# Altium schematic sheet AIRZAI_NFC_READER_FLEX.SchDoc
size A3
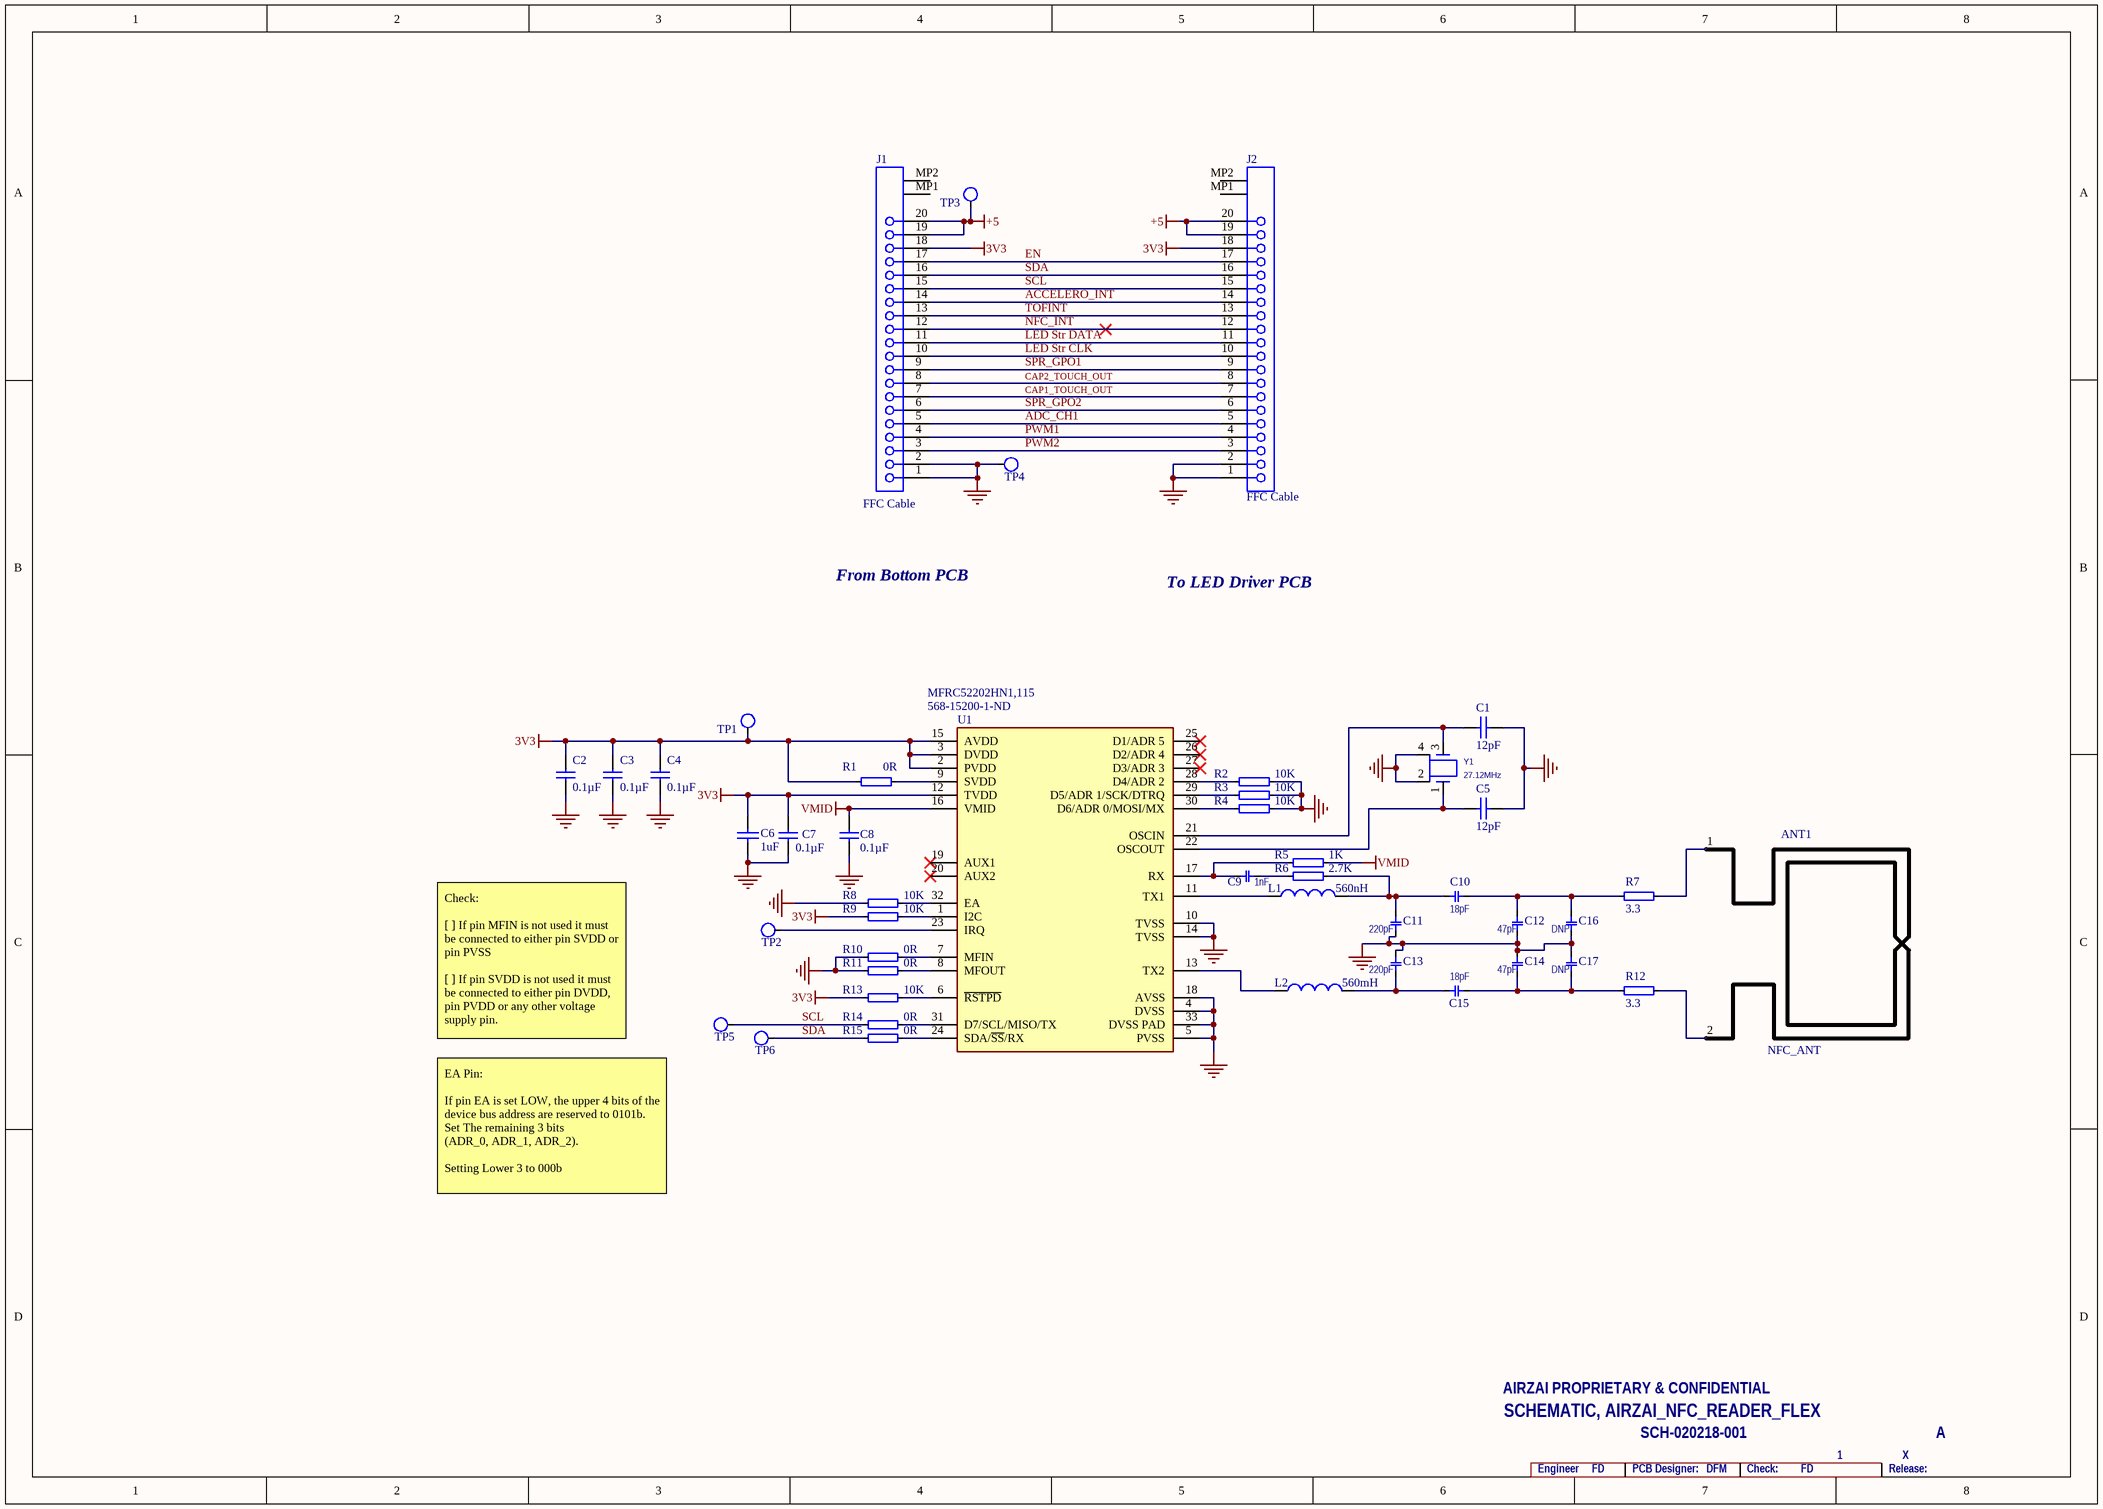
[diagram p0: AIRZAI_NFC_READER_FLEX.SchDoc]

## Parts
ANT1  NFC_ANT  [ANTENNA-NFC-60MMX30MM]
C1  12pF  [0402CAP]
C2  0.1µF  [0402CAP]
C3  0.1µF  [0402CAP]
C4  0.1µF  [0402CAP]
C5  12pF  [0402CAP]
C6  1uF  [CAPC0402(1005)60_M]
C7  0.1µF  [0402CAP]
C8  0.1µF  [0402CAP]
C9  1nF  [0402CAP]
C10  18pF  [0402CAP]
C11  220pF  [0402CAP]
C12  47pF  [0402CAP]
C13  220pF  [0402CAP]
C14  47pF  [0402CAP]
C15  18pF  [0402CAP]
C16  DNP  [0402CAP]
C17  DNP  [0402CAP]
J1  FFC Cable  [FFC_Pads_MBD]
J2  FFC Cable  [FFC_Pads_LID]
L1  560nH  [0603CAP]
L2  560mH  [0603CAP]
R1  0R  [0402]
R2  10K  [0402]
R3  10K  [0402]
R4  10K  [0402]
R5  1K  [0402]
R6  2.7K  [0402]
R7  3.3  [0603]
R8  10K  [0402]
R9  10K  [0402]
R10  0R  [0402]
R11  0R  [0402]
R12  3.3  [0603]
R13  10K  [0402]
R14  0R  [0402]
R15  0R  [0402]
TP1  WIREPT  [TP_0.9MM]  (value not drawn)
TP2  WIREPT  [TP_0.9MM]  (value not drawn)
TP3  WIREPT  [TP_0.9MM]  (value not drawn)
TP4  WIREPT  [TP_0.9MM]  (value not drawn)
TP5  WIREPT  [TP_0.9MM]  (value not drawn)
TP6  WIREPT  [TP_0.9MM]  (value not drawn)
U1  Supplier Part Number 1: 568-15200-1-ND  [VFQFN-32-MFRC52202HN1,157]  (hidden comment: MFRC52202HN1,115)
Y1  27.12MHz  [XTAL_2016]

## Nets
3V3: C2.1 C3.1 C4.1 C6.2 C7.1 J1.18 J2.18 R1.2 R9.2 R13.2 TP1.1 U1.2(PVDD) U1.3(DVDD) U1.12(TVDD) U1.15(AVDD)
+5: J1.19 J1.20 J2.19 J2.20 TP3.1
GND: C1.1 C2.2 C3.2 C4.2 C5.1 C6.1 C7.2 C8.2 C11.1 C12.1 C13.2 C14.2 C16.1 C17.2 J1.1 J1.2 J2.1 J2.2 R2.1 R3.1 R4.1 R8.2 R10.2 R11.2 TP4.1 U1.4(DVSS) U1.5(PVSS) U1.10(TVSS) U1.14(TVSS) U1.18(AVSS) U1.33(DVSS_PAD) Y1.2 Y1.4
VMID: C8.1 R5.1 U1.16(VMID)
ACCELERO_INT: J1.14 J2.14
ADC_CH1: J1.5 J2.5
CAP1_TOUCH_OUT: J1.7 J2.7
CAP2_TOUCH_OUT: J1.8 J2.8
EN: J1.17 J2.17
LED Str CLK: J1.10 J2.10
LED Str DATA: J1.11 J2.11
NFC_INT: J1.12 J2.12
PWM1: J1.4 J2.4
PWM2: J1.3 J2.3
SCL: J1.15 J2.15 R14.2 TP5.1
SDA: J1.16 J2.16 R15.2 TP6.1
SPR_GPO1: J1.9 J2.9
SPR_GPO2: J1.6 J2.6
TOFINT: J1.13 J2.13
NetANT1_1: ANT1.1 R7.1
NetANT1_2: ANT1.2 R12.1
NetC1_2: C1.2 U1.21(OSCIN) Y1.3
NetC5_2: C5.2 U1.22(OSCOUT) Y1.1
NetC9_1: C9.1 R6.2
NetC9_2: C9.2 R5.2 U1.17(RX)
NetC10_1: C10.1 C12.2 C16.2 R7.2
NetC10_2: C10.2 C11.2 L1.2 R6.1
NetC13_1: C13.1 C15.2 L2.2
NetC14_1: C14.1 C15.1 C17.1 R12.2
NetL1_1: L1.1 U1.11(TX1)
NetL2_1: L2.1 U1.13(TX2)
NetR1_1: R1.1 U1.9(SVDD)
NetR2_2: R2.2 U1.28(D4/ADR_2)
NetR3_2: R3.2 U1.29(D5/ADR_1/SCK/DTRQ)
NetR4_2: R4.2 U1.30(D6/ADR_0/MOSI/MX)
NetR8_1: R8.1 U1.32(EA)
NetR9_1: R9.1 U1.1(I2C)
NetR10_1: R10.1 U1.7(MFIN)
NetR11_1: R11.1 U1.8(MFOUT)
NetR13_1: R13.1 U1.6(~{RSTPD})
NetR14_1: R14.1 U1.31(D7/SCL/MISO/TX)
NetR15_1: R15.1 U1.24(SDA/~{SS}/RX)
NetTP2_1: TP2.1 U1.23(IRQ)

Not connected (* = marked no-connect by the designer): J1 MP1 MP2; J2 MP1 MP2; U1 19(AUX1)* 20(AUX2)* 25(D1/ADR_5)* 26(D2/ADR_4)* 27(D3/ADR_3)*

## Notes on the sheet
- From Bottom PCB
- To LED Driver PCB
- Check:
  [ ] If pin MFIN is not used it must be connected to either pin SVDD or pin PVSS
  [ ] If pin SVDD is not used it must be connected to either pin DVDD, pin PVDD or any other voltage supply pin.
- EA Pin:
  If pin EA is set LOW, the upper 4 bits of the device bus address are reserved to 0101b. Set The remaining 3 bits
  (ADR_0, ADR_1, ADR_2).
  Setting Lower 3 to 000b
- AIRZAI PROPRIETARY & CONFIDENTIAL
- SCHEMATIC, AIRZAI_NFC_READER_FLEX
- SCH-020218-001
- 1
- X
- A
- Engineer
- FD
- PCB Designer:
- DFM
- Check:
- Release:
- Title
- Size:
- Date:
- A3
- Number:
- Time:
- Revision:
- Sheet
- of
- File:

## Library data of the parts
C1 C5 = CAP: CAP CER 12PF 50V C0G/NP0 0402; Manufacturer: KEMET; Manufacturer Part Number: C0402C120J5GACTU; Dielectric Material: Ceramic; Tolerance: 5%; Dielectric: C0G; Temperature Coefficient: 30ppm/°C; Value: 12pF; ComponentLink1URL: https://www.yuden.co.jp/productdata/catalog/mlcc01_e.pdf?src-supplier=Digi-Key; ComponentLink1Description: https://www.yuden.co.jp/productdata/catalog/mlcc01_e.pdf?src-supplier=Digi-Key; ComponentLink2URL: http://www.onlinecomponents.com/productFiles/mf-TAI/964emk105bj105kv-f.pdf?src-supplier=Onlinecomponents.com; ComponentLink2Description: http://www.onlinecomponents.com/productFiles/mf-TAI/964emk105bj105kv-f.pdf?src-supplier=Onlinecomponents.com; ComponentLink3URL: http://www.farnell.com/datasheets/2091854.pdf?src-supplier=Element14; ComponentLink3Description: http://www.farnell.com/datasheets/2091854.pdf?src-supplier=Element14; ComponentLink4URL: https://www.verical.com/server-webapp/html/getDatasheet?partID=638287&src-supplier=Verical; ComponentLink4Description: https://www.verical.com/server-webapp/html/getDatasheet?partID=638287&src-supplier=Verical; ComponentLink5URL: http://ds.yuden.co.jp/TYCOMPAS/ut/detail.do?productNo=EMK105BJ105KV-F&fileName=EMK105BJ105KV-F_SS&mode=specSheetDownload&src-supplier=Mouser; ComponentLink5Description: http://ds.yuden.co.jp/TYCOMPAS/ut/detail.do?productNo=EMK105BJ105KV-F&fileName=EMK105BJ105KV-F_SS&mode=specSheetDownload&src-supplier=Mouser; ComponentLink6URL: http://www.farnell.com/datasheets/1497285.pdf?src-supplier=Element14; ComponentLink6Description: http://www.farnell.com/datasheets/1497285.pdf?src-supplier=Element14; Supplier 1: Digi-Key; Supplier Part Number 1: 399-1013-6-ND; Stock 1: 1653435; Pricing 1: 1=0.1, 10=0.055, 100=0.0243, 500=0.01738, 1000=0.01366, 2500=0.01242, 5000=0.01143 (USD); Mount: Surface Mount,PCB; Case/Package: 0402; Number of Pins: 2; Case Code (Metric): 1005; Case Code (Imperial): 0402; Min Operating Temperature: -55°C; Max Operating Temperature: 125°C; Capacitance: 12pF; Voltage Rating: 50V; Voltage Rating (DC): 50V; Packaging: Tape and Reel; Package Quantity: 1; Termination: SMD/SMT; Voltage: 50V; Length: 1mm; Height: 0.5mm; Width: 0.02inch; Thickness: 0.022inch; Lead Pitch: 0.3mm; Depth: 0.5mm; Radiation Hardening: No; REACH SVHC: No SVHC; Lead Free: Lead Free; ComponentLink7URL: http://www.farnell.com/datasheets/2119935.pdf?src-supplier=Element14; ComponentLink7Description: http://www.farnell.com/datasheets/2119935.pdf?src-supplier=Element14; ComponentLink8URL: http://www.farnell.com/datasheets/2740746.pdf?src-supplier=Newark; ComponentLink8Description: http://www.farnell.com/datasheets/2740746.pdf?src-supplier=Newark; ComponentLink9URL: http://www.mouser.com/ds/2/212/KEM_C1003_C0G_SMD-1101588.pdf?src-supplier=Mouser; ComponentLink9Description: http://www.mouser.com/ds/2/212/KEM_C1003_C0G_SMD-1101588.pdf?src-supplier=Mouser; ComponentLink10URL: https://www.alliedelec.com/m/d/9bfe7773041ffe9d406e68bc7b377fdd.pdf?src-supplier=Allied+Electronics; ComponentLink10Description: https://www.alliedelec.com/m/d/9bfe7773041ffe9d406e68bc7b377fdd.pdf?src-supplier=Allied+Electronics
C2-C4 C7 C8 = C0402-100n: Capacitor, X7R, ±10%; Manufacturer: TDK; Manufacturer Part Number: C1005X7R1C104K; Note: 16V ±10% X7R; Case-EIA: 0402; Case-Metric: 1005; Rated Voltage: 16 V; Tolerance: Â±20%; Datasheet: *; Footprint: 0402; Pin Count: 2; Value: 0.1µF; Supplier: *; Supplier part number: *; 2nd source Supplier: *; 2nd source part number: *; Max Thickness: 0.6 mm; Supplier 1: Digi-Key; Supplier Part Number 1: 445-4952-2-ND; Technology: SMT
C6 = CAP: CAP 1uF 16V ±10% 0402 (1005 Metric) Thickness 0.6mm SMD; Manufacturer: Taiyo Yuden; Manufacturer Part Number: EMK105BJ105KV-F; Dielectric: X5R; Value: 1uF; Supplier 1: Digi-Key; Supplier Part Number 1: 587-2477-6-ND; Stock 1: 1414379; Pricing 1: 1=0.1, 10=0.076, 100=0.0337, 500=0.02406, 1000=0.01891, 2500=0.01719, 5000=0.01581 (USD); Mount: Surface Mount; Case/Package: 0402; Number of Pins: 2; Case Code (Metric): 1005; Case Code (Imperial): 0402; Min Operating Temperature: -55°C; Max Operating Temperature: 85°C; Capacitance: 1uF; Tolerance: 10%; Packaging: Tape and Reel; Voltage Rating (DC): 16V; Package Quantity: 1; Voltage Rating: 16V; Termination: SMD/SMT; Length: 1mm; Height: 0.5mm; Width: 0.02inch; Thickness: 0.022inch; Depth: 0.5mm; Radiation Hardening: No; REACH SVHC: Unknown; Halogen Free: Halogen Free; ComponentLink1URL: https://www.yuden.co.jp/productdata/catalog/mlcc01_e.pdf?src-supplier=Digi-Key; ComponentLink1Description: https://www.yuden.co.jp/productdata/catalog/mlcc01_e.pdf?src-supplier=Digi-Key; ComponentLink2URL: http://www.onlinecomponents.com/productFiles/mf-TAI/964emk105bj105kv-f.pdf?src-supplier=Onlinecomponents.com; ComponentLink2Description: http://www.onlinecomponents.com/productFiles/mf-TAI/964emk105bj105kv-f.pdf?src-supplier=Onlinecomponents.com; ComponentLink3URL: http://www.farnell.com/datasheets/2091854.pdf?src-supplier=Element14; ComponentLink3Description: http://www.farnell.com/datasheets/2091854.pdf?src-supplier=Element14; ComponentLink4URL: https://www.verical.com/server-webapp/html/getDatasheet?partID=638287&src-supplier=Verical; ComponentLink4Description: https://www.verical.com/server-webapp/html/getDatasheet?partID=638287&src-supplier=Verical; ComponentLink5URL: http://ds.yuden.co.jp/TYCOMPAS/ut/detail.do?productNo=EMK105BJ105KV-F&fileName=EMK105BJ105KV-F_SS&mode=specSheetDownload&src-supplier=Mouser; ComponentLink5Description: http://ds.yuden.co.jp/TYCOMPAS/ut/detail.do?productNo=EMK105BJ105KV-F&fileName=EMK105BJ105KV-F_SS&mode=specSheetDownload&src-supplier=Mouser; ComponentLink6URL: http://www.farnell.com/datasheets/1497285.pdf?src-supplier=Element14; ComponentLink6Description: http://www.farnell.com/datasheets/1497285.pdf?src-supplier=Element14
C9 = 56p: CAP CER 1000PF 50V C0G/NP0 0402; Manufacturer: Murata; Manufacturer Part Number: GRM1555C1H102FA01D; Material: Ceramic; Tolerance: 1%; Dielectric: C0G; VALUE: 1nF; Supplier 1: Digi-Key; Supplier Part Number 1: 490-6189-1-ND; Stock 1: 2792285; Pricing 1: 1 = 0.23000, 10 = 0.15400, 100 = 0.07780, 500 = 0.05322, 1000 = 0.04708, 2500 = 0.04504, 5000 = 0.04094 (USD); RoHS: Yes; Mount: Surface Mount; Case/Package: 0402; Case Code (Metric): 1005; Case Code (Imperial): 0402; Min Operating Temperature: -55°C; Max Operating Temperature: 125°C; Capacitance: 1nF; Packaging: Tape and Reel; Package Quantity: 1; Voltage Rating: 50V; Termination: SMD/SMT; Voltage: 50V; Voltage Rating (DC): 50V; Length: 1mm; Height: 0.5mm; Width: 0.02inch; Thickness: 0.022inch; Depth: 0.5mm; Radiation Hardening: No; REACH SVHC: No SVHC; Lead Free: Lead Free; ComponentLink1URL: https://datasheet.ciiva.com/11621/c02e-11621677.pdf?src-supplier=Avnet; ComponentLink1Description: https://datasheet.ciiva.com/11621/c02e-11621677.pdf?src-supplier=Avnet; ComponentLink2URL: https://datasheet.ciiva.com/6270/partnumbering-e-01-6270478.pdf?src-supplier=Digi-Key; ComponentLink2Description: https://datasheet.ciiva.com/6270/partnumbering-e-01-6270478.pdf?src-supplier=Digi-Key; ComponentLink3URL: https://datasheet.ciiva.com/6270/partnumbering-e-01-6270477.pdf?src-supplier=Digi-Key; ComponentLink3Description: https://datasheet.ciiva.com/6270/partnumbering-e-01-6270477.pdf?src-supplier=Digi-Key
C10 C15 = 56p: CAP CER 18PF 50V NP0 0402; Manufacturer: Kyocera AVX; Manufacturer Part Number: 04025U180FAT2A; Tolerance: 1%; Dielectric: C0G; VALUE: 18pF; ComponentLink1URL: https://datasheet.ciiva.com/6257/kem-c1030-cbr-smd-6257578.pdf?src-supplier=Digi-Key; ComponentLink1Description: https://datasheet.ciiva.com/6257/kem-c1030-cbr-smd-6257578.pdf?src-supplier=Digi-Key; ComponentLink2URL: https://datasheet.ciiva.com/6257/kem-c1030-cbr-smd-6257580.pdf?src-supplier=Digi-Key; ComponentLink2Description: https://datasheet.ciiva.com/6257/kem-c1030-cbr-smd-6257580.pdf?src-supplier=Digi-Key; ComponentLink3URL: https://datasheet.ciiva.com/6257/kem-c1030-cbr-smd-6257582.pdf?src-supplier=Digi-Key; ComponentLink3Description: https://datasheet.ciiva.com/6257/kem-c1030-cbr-smd-6257582.pdf?src-supplier=Digi-Key; Supplier 1: Digi-Key; Supplier Part Number 1: 478-10144-1-ND; Stock 1: 9413; Pricing 1: 1 = 0.38000, 10 = 0.26300, 100 = 0.15780, 500 = 0.11832, 1000 = 0.09991, 2500 = 0.09465, 5000 = 0.08939 (USD); RoHS: Yes; Mount: Surface Mount; Case/Package: 0402; Case Code (Metric): 1005; Case Code (Imperial): 0402; Contact Plating: Tin; Min Operating Temperature: -55°C; Max Operating Temperature: 125°C; Capacitance: 18pF; Package Quantity: 10000; Voltage Rating: 50V; Packaging: Tape and Reel; Voltage Rating (DC): 50V; Termination: SMD/SMT; Composition: Ceramic; Length: 1mm; Width: 0.02inch; Thickness: 0.022inch; Depth: 0.5mm; Radiation Hardening: No; Lead Free: Lead Free; ComponentLink4URL: https://datasheet.ciiva.com/6269/useries-6269560.pdf?src-supplier=Digi-Key; ComponentLink4Description: https://datasheet.ciiva.com/6269/useries-6269560.pdf?src-supplier=Digi-Key; ComponentLink5URL: https://datasheet.ciiva.com/16327/useries-16327647.pdf?src-supplier=Future+Electronics; ComponentLink5Description: https://datasheet.ciiva.com/16327/useries-16327647.pdf?src-supplier=Future+Electronics
C11 C13 = 56p: CAP CER 220PF 50V NPO 0402; Manufacturer: Yageo; Manufacturer Part Number: CC0402FRNPO9BN221; Tolerance: 1%; Dielectric: C0G; VALUE: 220pF; ComponentLink1URL: https://datasheet.ciiva.com/15189/getdatasheetpartid-317481-15189141.pdf?src-supplier=Verical; ComponentLink1Description: https://datasheet.ciiva.com/15189/getdatasheetpartid-317481-15189141.pdf?src-supplier=Verical; ComponentLink2URL: https://datasheet.ciiva.com/11587/upy-gp-np0-16v-to-50v-8-11587311.pdf?src-supplier=Avnet; ComponentLink2Description: https://datasheet.ciiva.com/11587/upy-gp-np0-16v-to-50v-8-11587311.pdf?src-supplier=Avnet; ComponentLink3URL: https://datasheet.ciiva.com/13264/upy-gp-np0-16v-to-50v-8-3714-13264357.pdf?src-supplier=Mouser; ComponentLink3Description: https://datasheet.ciiva.com/13264/upy-gp-np0-16v-to-50v-8-3714-13264357.pdf?src-supplier=Mouser; ComponentLink4URL: https://datasheet.ciiva.com/16623/upy-gp-np0-16v-to-50v-8-16623951.pdf?src-supplier=Avnet+Europe; ComponentLink4Description: https://datasheet.ciiva.com/16623/upy-gp-np0-16v-to-50v-8-16623951.pdf?src-supplier=Avnet+Europe; Supplier 1: Digi-Key; Supplier Part Number 1: 311-3730-1-ND; Stock 1: 23487; Pricing 1: 1 = 0.17000, 10 = 0.11700, 100 = 0.05520, 500 = 0.03872, 1000 = 0.03205, 2500 = 0.02983, 5000 = 0.02729 (USD); RoHS: Yes; Mount: Surface Mount; Case/Package: 0402; Weight: 2.3E-05oz; Case Code (Imperial): 0402; Case Code (Metric): 1005; Min Operating Temperature: -55°C; Max Operating Temperature: 125°C; Packaging: Tape and Reel; Voltage Rating: 50V; Voltage Rating (DC): 50V; Capacitance: 220pF; Termination: SMD/SMT; Composition: Ceramic; Length: 1mm; Height: 0.5mm; Width: 0.5mm; Thickness: 0.022inch; Depth: 0.5mm; Radiation Hardening: No; Lead Free: Lead Free; ComponentLink5URL: https://datasheet.ciiva.com/17434/upy-gp-np0-16v-to-50v-8-17434283.pdf?src-supplier=Avnet+Europe; ComponentLink5Description: https://datasheet.ciiva.com/17434/upy-gp-np0-16v-to-50v-8-17434283.pdf?src-supplier=Avnet+Europe; ComponentLink6URL: https://datasheet.ciiva.com/26918/getdatasheetpartid-403443-26918299.pdf?src-supplier=Verical; ComponentLink6Description: https://datasheet.ciiva.com/26918/getdatasheetpartid-403443-26918299.pdf?src-supplier=Verical
C12 C14 = 56p: CAP CER 47PF 50V C0G/NP0 0402; Manufacturer: Murata; Manufacturer Part Number: GJM1555C1H470FB01D; Tolerance: 1%; Dielectric: C0G; VALUE: 47pF; Supplier 1: Digi-Key; Supplier Part Number 1: 490-16376-1-ND; Stock 1: 48815; Pricing 1: 1 = 0.28000, 10 = 0.19300, 100 = 0.09760, 500 = 0.06678, 1000 = 0.05908, 2500 = 0.05651, 5000 = 0.05137 (USD); RoHS: No; Capacitance: 47pF; Voltage Rating (DC): 50V; Length: 1mm; Thickness: 500um; Width: 500um; ComponentLink1URL: http://search.murata.co.jp/Ceramy/image/img/A01X/G101/ENG/GJM1555C1H470FB01-01.pdf?src-supplier=Digi-Key; ComponentLink1Description: http://search.murata.co.jp/Ceramy/image/img/A01X/G101/ENG/GJM1555C1H470FB01-01.pdf?src-supplier=Digi-Key
C16 C17 = 56p: VALUE: DNP; ComponentLink1URL: http://search.murata.co.jp/Ceramy/image/img/A01X/G101/ENG/GJM1555C1H470FB01-01.pdf?src-supplier=Digi-Key; ComponentLink1Description: http://search.murata.co.jp/Ceramy/image/img/A01X/G101/ENG/GJM1555C1H470FB01-01.pdf?src-supplier=Digi-Key
J1 J2 = XF2M-2015-1A-R100: Cable; ComponentLink1URL: http://www.molex.com/molex/index.jsp; ComponentLink2URL: http://www.molex.com/webdocs/datasheets/pdf/en-us/0528922033_FFC_FPC_CONNECTORS.pdf; ComponentLink3Description: Package Specification; ComponentLink3URL: http://www.molex.com/pdm_docs/sd/528922033_sd.pdf; ComponentLink1Description: Manufacturer URL
L1 L2 = Inductor: FIXED IND 560NH 100MA 1.05 OHM; Manufacturer: TDK; Manufacturer Part Number: MLF1608DR56JTD25; Core Material: Ferrite; Tolerance: 5%; DC Resistance (DCR): 1.05R; Shielding: Shielded; Self Resonant Frequency: 170MHz; Test Frequency: 25MHz; Max DC Current: 30mA; Q Factor: 35; Supplier 1: Digi-Key; Supplier Part Number 1: 445-16970-1-ND; Stock 1: 60308; Pricing 1: 1 = 0.33000, 10 = 0.29000, 100 = 0.19920, 500 = 0.17026, 1000 = 0.13041 (USD); RoHS: Yes; Mount: Surface Mount; Case/Package: 0603; Weight: 0.000141oz; Case Code (Metric): 1608; Case Code (Imperial): 0603; Min Operating Temperature: -55°C; Max Operating Temperature: 125°C; Inductance: 560nH; Packaging: Tape and Reel; Package Quantity: 4000; Current Rating: 100mA; Termination: SMD/SMT; Length: 0.063inch; Height: 0.8mm; Width: 0.8mm; Height - Seated (Max): 0.037inch; Ratings: AEC-Q200; ComponentLink1URL: https://datasheet.ciiva.com/41835/inductor-automotive-standard-mlf-en-41835679.pdf?src-supplier=Digi-Key; ComponentLink1Description: https://datasheet.ciiva.com/41835/inductor-automotive-standard-mlf-en-41835679.pdf?src-supplier=Digi-Key
  L1: Value: 560nH
  L2: Value: 560mH
R1 R10 R11 R14 R15 = R0402-12k: Resistor, ±1%, 0.063W; Manufacturer: Panasonic; Manufacturer Part Number: ERJ-2GE0R00X; Note: 0.1W JUMPER; Case-Metric: 1005; Tolerance: ±5%; Datasheet: *; Pin Count: 2; Value: 0R; 2nd source Supplier: *; 2nd source part number: *; Case-EIA: 0402; Max Thickness: 0.6mm; Supplier 1: Digi-Key; Supplier Part Number 1: P0.0JTR-ND; Technology: SMT
R2-R4 R8 R9 R13 = R0402-12k: Resistor 10K, ±1%, 0.063W; Manufacturer: Vishay Dale; Manufacturer Part Number: CRCW040210K0JNED; Resistance: 10kR; Power Rating: 63mW; Tolerance: 5%; Voltage Rating: 50V; Temperature Coefficient: 200ppm/°C; Value: 10K; Supplier 1: Digi-Key; Supplier Part Number 1: 541-10KJDKR-ND; Stock 1: 2; Pricing 1: 1=0.1, 10=0.034, 100=0.0138, 1000=0.00618, 2500=0.00536, 5000=0.00443 (USD); Mount: Surface Mount; Case/Package: 0402; Weight: 2.3E-05oz; Case Code (Imperial): 0402; Case Code (Metric): 1005; Contact Plating: Tin; Min Operating Temperature: -55°C; Max Operating Temperature: 155°C; Packaging: Tape and Reel; Package Quantity: 1; Termination: SMD/SMT; Composition: Thick Film; Number of Terminations: 2; Military Standard: Not; Max Power Dissipation: 63mW; Features: Automotive AEC-Q200; Length: 1mm; Height: 0.016inch; Width: 0.5mm; Depth: 0.5mm; Radiation Hardening: No; REACH SVHC: Unknown; ComponentLink1URL: http://www.vishay.com/docs/20035/dcrcwe3.pdf?src-supplier=Digi-Key; ComponentLink1Description: http://www.vishay.com/docs/20035/dcrcwe3.pdf?src-supplier=Digi-Key; ComponentLink2URL: http://www.farnell.com/datasheets/2045673.pdf?src-supplier=Element14; ComponentLink2Description: http://www.farnell.com/datasheets/2045673.pdf?src-supplier=Element14; ComponentLink3URL: https://www.alliedelec.com/m/d/0c934d6939ccefa68dbe0b96d821c8cf.pdf?src-supplier=Allied+Electronics; ComponentLink3Description: https://www.alliedelec.com/m/d/0c934d6939ccefa68dbe0b96d821c8cf.pdf?src-supplier=Allied+Electronics; ComponentLink4URL: http://www.vishay.com/docs/20035/dcrcwe3.pdf?src-supplier=Avnet; ComponentLink4Description: http://www.vishay.com/docs/20035/dcrcwe3.pdf?src-supplier=Avnet
R5 = R0402-12k: RES SMD 1K OHM 1% 1/16W 0402; Manufacturer: Yageo; Manufacturer Part Number: RC0402FR-071KL; Resistance: 1kR; Temperature Coefficient: 100ppm/°C; Power Rating: 62.5mW; Voltage Rating (DC): 50V; Value: 1K; Supplier 1: Digi-Key; Supplier Part Number 1: 311-1.00KLRCT-ND; Stock 1: 71399230; Pricing 1: 1 = 0.10000, 10 = 0.01600, 100 = 0.00670, 1000 = 0.00301, 2500 = 0.00261, 5000 = 0.00215 (USD); RoHS: Yes; Case/Package: 0402; Number of Pins: 2; Case Code (Imperial): 0402; Case Code (Metric): 1005; Min Operating Temperature: -55°C; Max Operating Temperature: 155°C; Tolerance: 1%; Packaging: Tape and Reel; Composition: Thick Film; Voltage Rating: 50V; Termination: SMD/SMT; Military Standard: Not; Length: 1mm; Height: 0.32mm; Width: 0.5mm; Depth: 0.5mm; REACH SVHC: Unknown; Lead Free: Lead Free; ComponentLink1URL: https://datasheet.ciiva.com/11819/0900766b80c66297-11819477.pdf?src-supplier=RSComponents; ComponentLink1Description: https://datasheet.ciiva.com/11819/0900766b80c66297-11819477.pdf?src-supplier=RSComponents; ComponentLink2URL: https://datasheet.ciiva.com/12666/pyu-rc0402-51-rohs-l-6-r-12666741.pdf?src-supplier=Mouser; ComponentLink2Description: https://datasheet.ciiva.com/12666/pyu-rc0402-51-rohs-l-6-r-12666741.pdf?src-supplier=Mouser; ComponentLink3URL: https://datasheet.ciiva.com/17063/pyu-rc0402-51-rohs-l-6-r-17063193.pdf?src-supplier=Future+Electronics; ComponentLink3Description: https://datasheet.ciiva.com/17063/pyu-rc0402-51-rohs-l-6-r-17063193.pdf?src-supplier=Future+Electronics; ComponentLink4URL: https://datasheet.ciiva.com/22747/1018594-22747513.pdf?src-supplier=Element14; ComponentLink4Description: https://datasheet.ciiva.com/22747/1018594-22747513.pdf?src-supplier=Element14; ComponentLink5URL: https://datasheet.ciiva.com/7849/1018594-7849869.pdf?src-supplier=Element14; ComponentLink5Description: https://datasheet.ciiva.com/7849/1018594-7849869.pdf?src-supplier=Element14; ComponentLink6URL: https://datasheet.ciiva.com/7983/1018594-7983502.pdf?src-supplier=Element14; ComponentLink6Description: https://datasheet.ciiva.com/7983/1018594-7983502.pdf?src-supplier=Element14; ComponentLink7URL: https://datasheet.ciiva.com/7849/1018594-7849871.pdf?src-supplier=Element14; ComponentLink7Description: https://datasheet.ciiva.com/7849/1018594-7849871.pdf?src-supplier=Element14
R6 = R0402-12k: RES SMD 2.7K OHM 1% 1/16W 0402; Manufacturer: Yageo Phycomp; Manufacturer Part Number: RC0402FR-072K7L; Power Rating: 63mW; Temperature Coefficient: 100ppm/°C; Resistance: 2.7kR; Voltage Rating (DC): 50V; Value: 2.7K; Supplier 1: Digi-Key; Supplier Part Number 1: 311-2.70KLRCT-ND; Stock 1: 1726987; Pricing 1: 1 = 0.10000, 10 = 0.01600, 100 = 0.00670, 1000 = 0.00301, 2500 = 0.00261, 5000 = 0.00215 (USD); RoHS: Yes; Mount: Surface Mount; Case/Package: 0402; Number of Pins: 2; Min Operating Temperature: -55°C; Max Operating Temperature: 155°C; Tolerance: 1%; Packaging: Cut Tape; Length: 1mm; Height: 0.32mm; Depth: 0.5mm; Width: 500um; REACH SVHC: No SVHC; Lead Free: Lead Free; ComponentLink1URL: http://www.farnell.com/datasheets/2167052.pdf?src-supplier=Farnell; ComponentLink1Description: http://www.farnell.com/datasheets/2167052.pdf?src-supplier=Farnell; ComponentLink2URL: http://www.yageo.com/documents/recent/PYu-RC_Group_51_RoHS_L_10.pdf?src-supplier=Digi-Key; ComponentLink2Description: http://www.yageo.com/documents/recent/PYu-RC_Group_51_RoHS_L_10.pdf?src-supplier=Digi-Key; ComponentLink3URL: http://www.yageo.com/documents/recent/PYu-RC_Group_51_RoHS_L_9.pdf?src-supplier=Digi-Key; ComponentLink3Description: http://www.yageo.com/documents/recent/PYu-RC_Group_51_RoHS_L_9.pdf?src-supplier=Digi-Key; ComponentLink4URL: http://www.farnell.com/datasheets/2167052.pdf?src-supplier=Newark; ComponentLink4Description: http://www.farnell.com/datasheets/2167052.pdf?src-supplier=Newark; ComponentLink5URL: http://documents.rs-components.com/techlib://itc_doclist_GB.htm?stockno=6186554&src-supplier=RSComponents; ComponentLink5Description: http://documents.rs-components.com/techlib://itc_doclist_GB.htm?stockno=6186554&src-supplier=RSComponents
R7 R12 = R0402-12k: RES SMD 3.3 OHM 1% 1/10W 0603; Manufacturer: Yageo; Manufacturer Part Number: AC0603FR-073R3L; Resistance: 3.3R; Max Power Dissipation: 100mW; Temperature Coefficient: 200ppm/°C; Value: 3.3; Supplier 1: Digi-Key; Supplier Part Number 1: YAG5335CT-ND; Stock 1: 21144; Pricing 1: 1 = 0.10000, 10 = 0.05800, 100 = 0.02350, 1000 = 0.01057, 2500 = 0.00918 (USD); RoHS: Yes; Case/Package: 0603; Min Operating Temperature: -55°C; Max Operating Temperature: 155°C; Packaging: Tape and Reel; Composition: Thick Film; Number of Terminations: 2; Tolerance: 1%; Features: Moisture Resistant; Length: 0.063inch; Height: 0.022inch; Width: 0.031inch; ComponentLink1URL: http://www.yageo.com/NewPortal/yageodocoutput?fileName=/pdf/R-Chip/PYu-AC_51_RoHS_L_6.pdf&src-supplier=Digi-Key; ComponentLink1Description: http://www.yageo.com/NewPortal/yageodocoutput?fileName=/pdf/R-Chip/PYu-AC_51_RoHS_L_6.pdf&src-supplier=Digi-Key; ComponentLink2URL: http://www.yageo.com/NewPortal/yageodocoutput?fileName=/pdf/R-Chip/PYu-AC_51_RoHS_L_5.pdf&src-supplier=Digi-Key; ComponentLink2Description: http://www.yageo.com/NewPortal/yageodocoutput?fileName=/pdf/R-Chip/PYu-AC_51_RoHS_L_5.pdf&src-supplier=Digi-Key
U1 = MFRC52201HN1,157: IC RFID READER 13.56MHZ 32HVQFN; Manufacturer: NXP Semiconductors; ComponentLink2Description: Datasheet; ComponentLink1URL: https://upverter.com/upn/revision/969ab42917e1bb0e/; ComponentLink1Description: Upverter; ComponentLink2URL: https://media.digikey.com/pdf/Data%20Sheets/NXP%20PDFs/MFRC522.pdf; Value: MFRC52202HN1,115; Supplier 1: Digi-Key; Manufacturer Part Number: MFRC52202HN1,115; Stock 1: 558; Pricing 1: 1 = 6.54000, 10 = 5.83700, 25 = 5.25280, 100 = 4.78590, 250 = 4.31904, 500 = 3.87544 (USD); RoHS: Yes; Number of Pins: 32; Min Operating Temperature: -25°C; Max Operating Temperature: 85°C; Packaging: Tape and Reel; Frequency: 13.56MHz; Package Quantity: 1500; Radiation Hardening: No; ComponentLink3URL: https://datasheet.ciiva.com/15040/mfrc522-15040655.pdf?src-supplier=Digi-Key; ComponentLink3Description: https://datasheet.ciiva.com/15040/mfrc522-15040655.pdf?src-supplier=Digi-Key
Y1 = ZTB_2: CRYSTAL 27.12MHZ 10PF SMD; Manufacturer: ECS International; Manufacturer Part Number: ECS-271.2-10-37-CKM-TR; Value: 27.12MHz; ComponentLink1URL: http://www.murata.com/products/catalog/pdf/p79e.pdf; ComponentLink1Description: http://www.murata.com/products/catalog/pdf/p79e.pdf; Supplier 1: Digi-Key; Supplier Part Number 1: XC2511DKR-ND; Stock 1: 1000; Pricing 1: 1=0.74, 10=0.613, 50=0.552, 100=0.4906, 500=0.46608 (USD)